# EAGLE design boat5 (EAGLE 7.2.0)
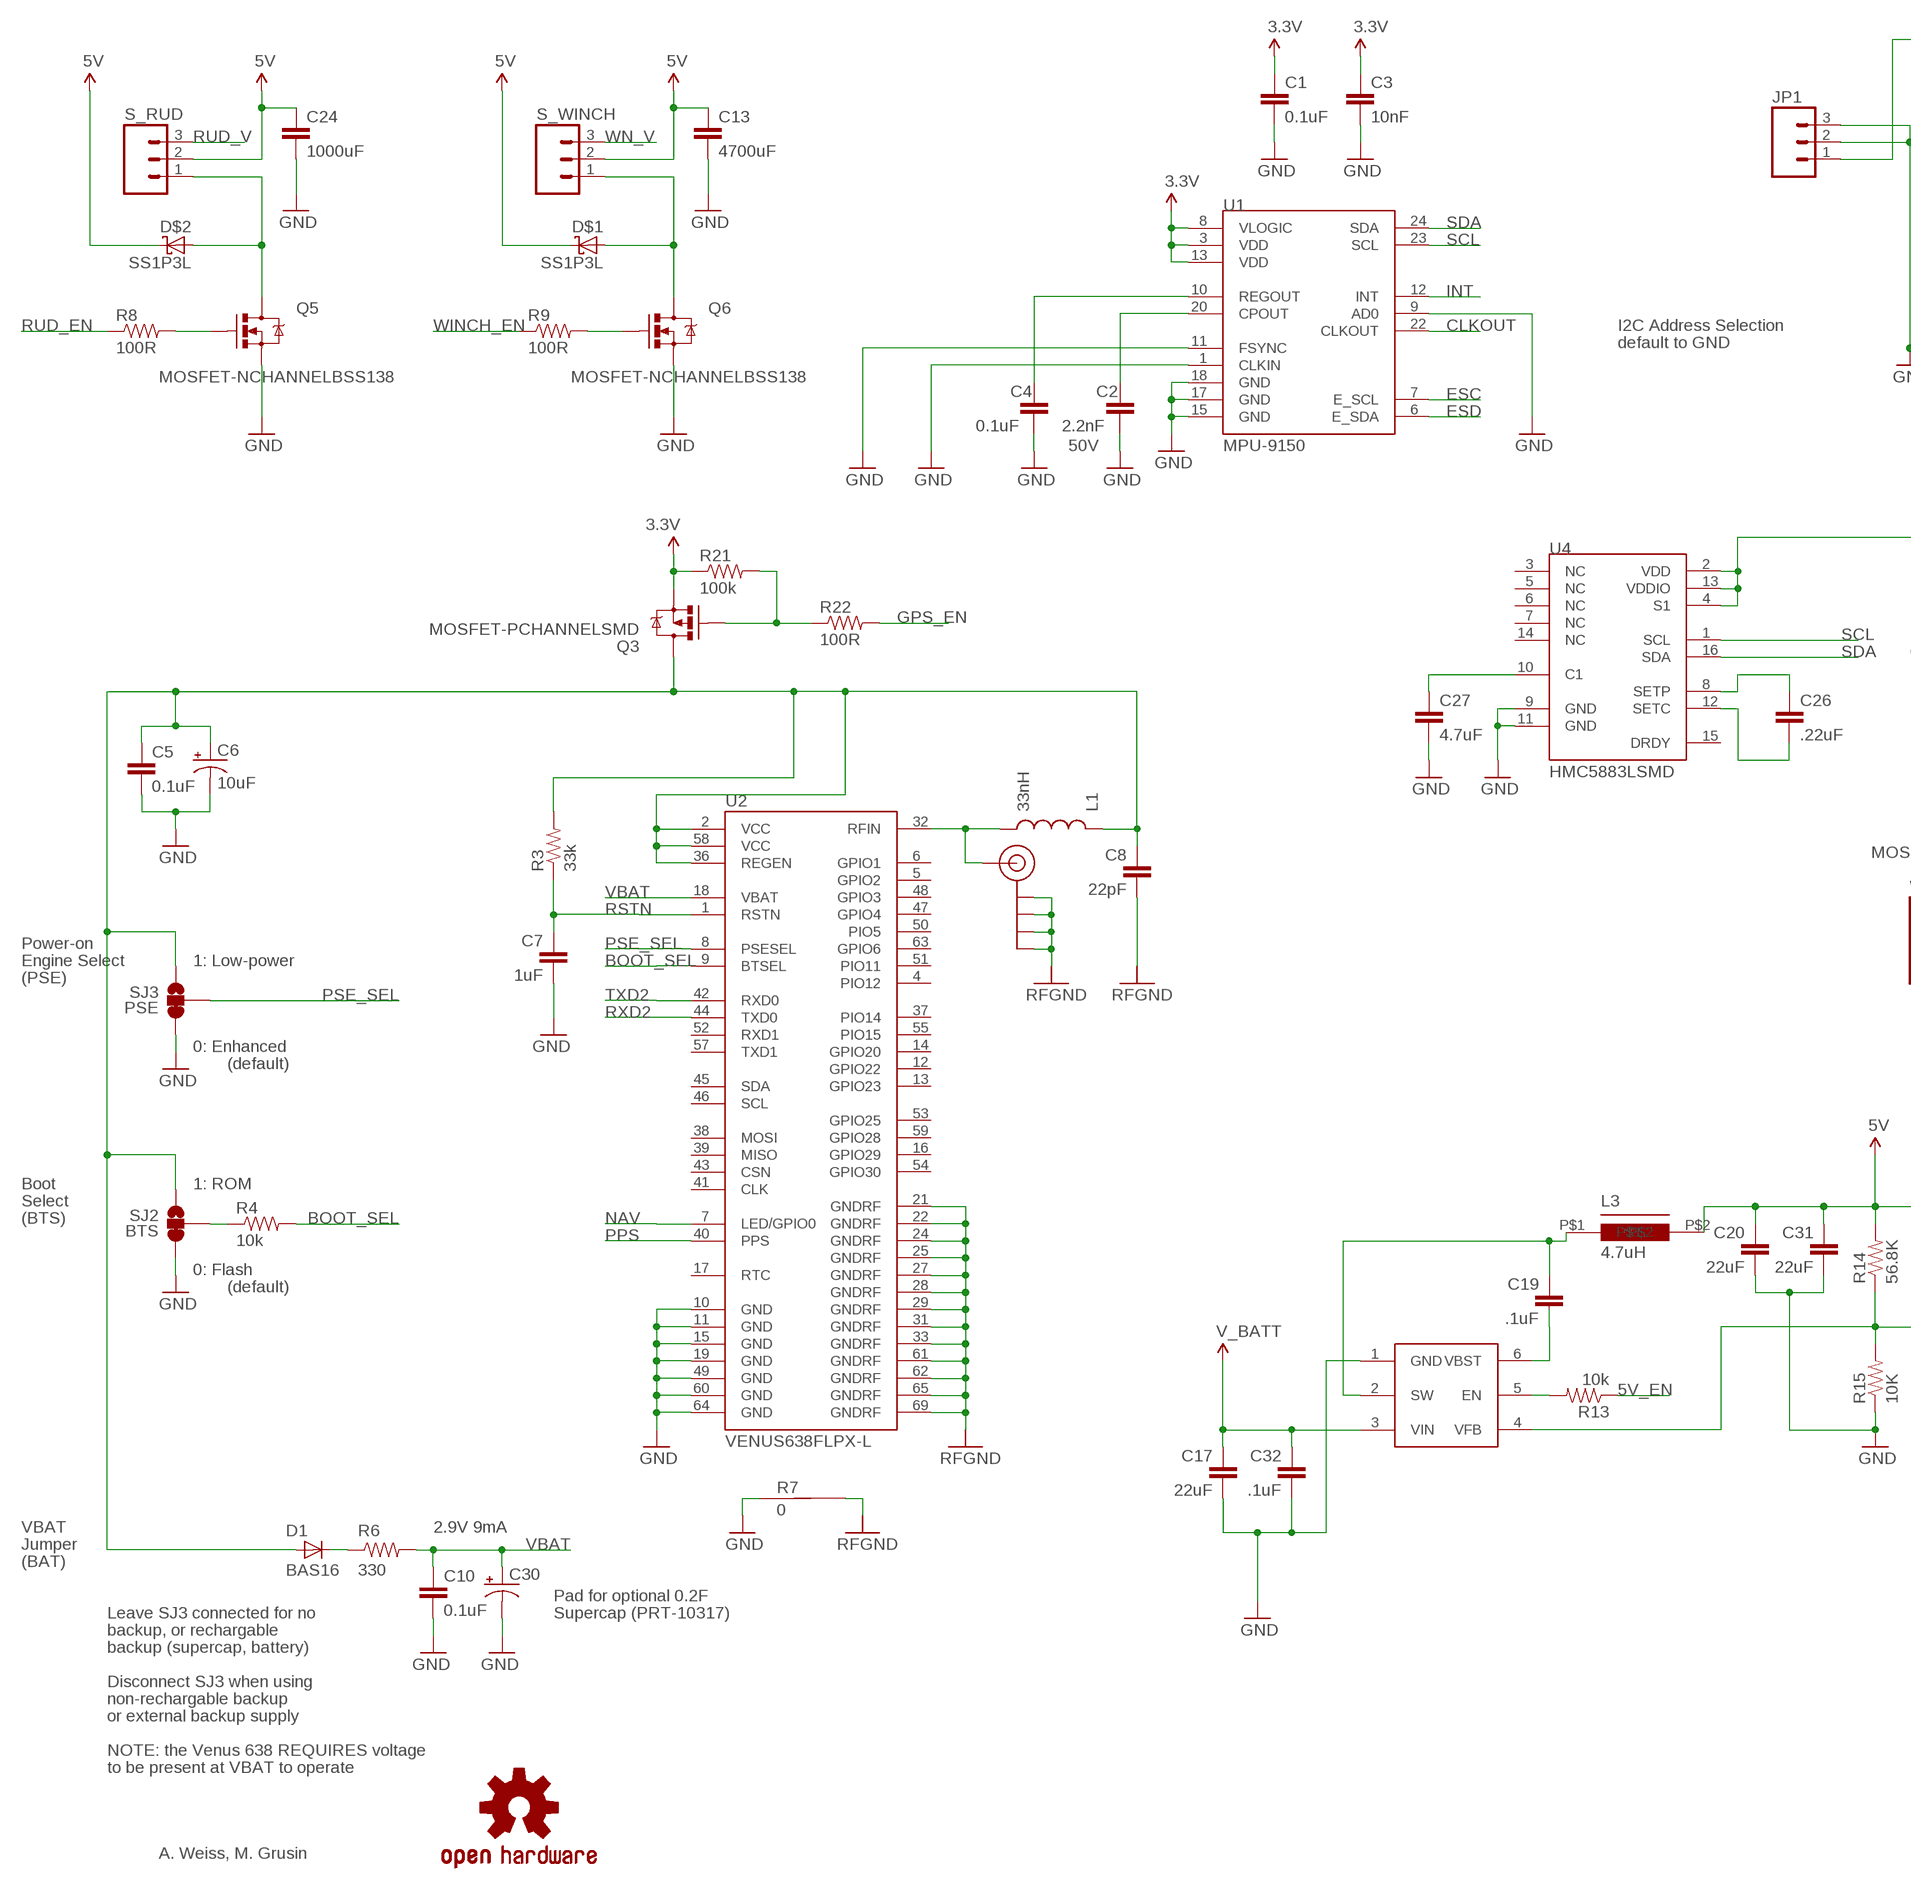
[diagram p0: schematic, sheet 1, part 1 of 2]
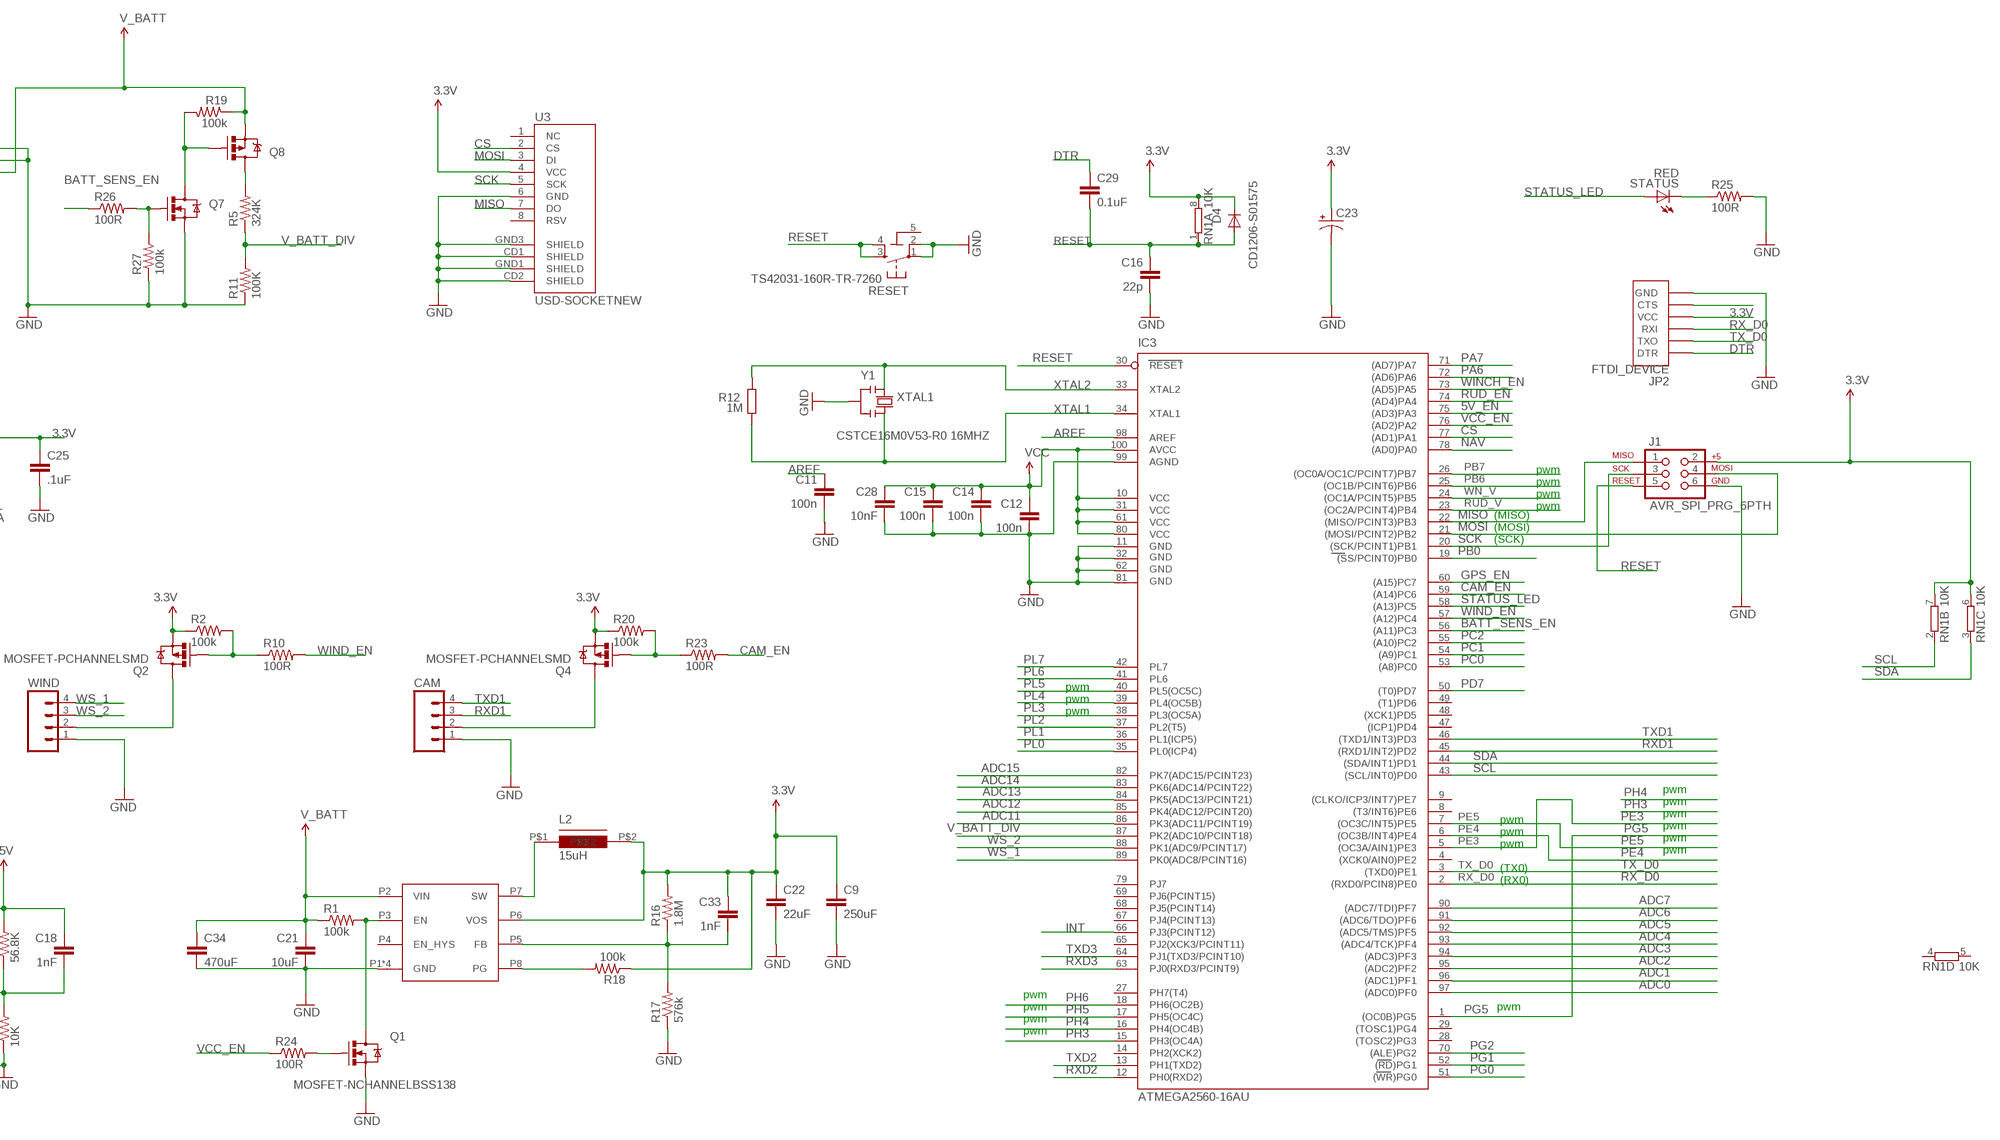
[diagram p1: schematic, sheet 1, part 2 of 2]

## Parts
C1  0.1uF  CAP0603-CAP  [0603-CAP]
C2  2.2nF  CAP0603-CAP  [0603-CAP]
C3  10nF  CAP0603-CAP  [0603-CAP]
C4  0.1uF  CAP0603-CAP  [0603-CAP]
C5  0.1uF  CAP0603-CAP  [0603-CAP]
C6  10uF  CAP_POL1206  [EIA3216]
C7  1uF  CAP0603-CAP  [0603-CAP]
C8  22pF  CAP0603-CAP  [0603-CAP]
C9  250uF  CAPPTH1  [CAP-PTH-5MM]
C10  0.1uF  CAP0603-CAP  [0603-CAP]
C11  100n  C-EU0603-RND  [C0603-ROUND]
C12  100n  C-EU0603-RND  [C0603-ROUND]
C13  4700uF  CAPPTH1  [CAP-PTH-5MM]
C14  100n  C-EU0603-RND  [C0603-ROUND]
C15  100n  C-EU0603-RND  [C0603-ROUND]
C16  22p  C-EU0603-RND  [C0603-ROUND]
C17  22uF  CAP1206  [1206]
C18  1nF  CAP0805  [0805]
C19  .1uF  CAP0805  [0805]
C20  22uF  CAP1206  [1206]
C21  10uF  CAP0805  [0805]
C22  22uF  CAP0805  [0805]
C23  CAP_POL  [DSK-621]
C24  1000uF  CAPPTH1  [CAP-PTH-5MM]
C25  .1uF  CAP0603-CAP  [0603-CAP]
C26  .22uF  CAP0603-CAP  [0603-CAP]
C27  4.7uF  CAP0603-CAP  [0603-CAP]
C28  10nF  CAP0603-CAP  [0603-CAP]
C29  0.1uF  CAP0402-CAP  [0402-CAP]
C30  CAP_POL  [DSK-621]
C31  22uF  CAP1206  [1206]
C32  .1uF  CAP0805  [0805]
C33  1nF  CAP0402-CAP  [0402-CAP]
C34  470uF  CAPPTH1  [CAP-PTH-5MM]
CAM  M04PTH  [1X04]
D1  BAS16  DIODESOD  [SOD-323]
D4  CD1206-S01575  DIODE-MINIMELF  [MINIMELF]
D$1  SS1P3L  [MICROSMP]
D$2  SS1P3L  [MICROSMP]
IC3  ATMEGA2560-16AU  ATMEGA25602560-16AU  [TQFP100]
J1  AVR_SPI_PRG_6PTH  [2X3]
JP1  M03SCREW  [SCREWTERMINAL-3.5MM-3]
JP2  FTDI_DEVICE  [FTDI_DEVICE_SIDE]
JP5  SMA_EDGE  [SMA-EDGE]
L1  33nH  INDUCTOR0603  [0603]
L2  15uH  VLCF4020  [VLCF4020]
L3  4.7uH  SLF60287055  [SLF7055]
Q1  MOSFET-NCHANNELBSS138  [SOT23]
Q2  MOSFET-PCHANNELSMD  [SOT23-3]
Q3  MOSFET-PCHANNELSMD  [SOT23-3]
Q4  MOSFET-PCHANNELSMD  [SOT23-3]
Q5  MOSFET-NCHANNELBSS138  [SOT23]
Q6  MOSFET-NCHANNELBSS138  [SOT23]
Q7  MOSFET-NCHANNELBSS138  [SOT23]
Q8  MOSFET-PCHANNELSMD  [SOT23-3]
R1  100k  RESISTOR0603  [0603-RES]
R2  100k  RESISTOR0603  [0603-RES]
R3  33k  RESISTOR0603-RES  [0603-RES]
R4  10k  RESISTOR0603-RES  [0603-RES]
R5  324K  RESISTOR0603-RES  [0603-RES]
R6  330  RESISTOR0603-RES  [0603-RES]
R7  0  GND-JUMP  [GND-JUMP]
R8  100R  RESISTOR0603  [0603-RES]
R9  100R  RESISTOR0603  [0603-RES]
R10  100R  RESISTOR0603  [0603-RES]
R11  100K  RESISTOR0603-RES  [0603-RES]
R12  1M  R-EU_R0603  [R0603-ROUND]
R13  10k  RESISTOR0603  [0603-RES]
R14  56.8K  RESISTOR0603  [0603-RES]
R15  10K  RESISTOR0603  [0603-RES]
R16  1.8M  RESISTOR0603  [0603-RES]
R17  576k  RESISTOR0603  [0603-RES]
R18  100k  RESISTOR0603  [0603-RES]
R19  100k  RESISTOR0603  [0603-RES]
R20  100k  RESISTOR0603  [0603-RES]
R21  100k  RESISTOR0603  [0603-RES]
R22  100R  RESISTOR0603  [0603-RES]
R23  100R  RESISTOR0603  [0603-RES]
R24  100R  RESISTOR0603  [0603-RES]
R25  100R  RESISTOR0603  [0603-RES]
R26  100R  RESISTOR0603  [0603-RES]
R27  100k  RESISTOR0603  [0603-RES]
RESET  TS42031-160R-TR-7260  TS42  [TS42]
RN1  10K  4R-NCAT16  [CAT16]
S_RUD  M03PTH  [1X03]
S_WINCH  M03PTH  [1X03]
SJ2  BTS  SOLDERJUMPER_2WAYPASTE2&3  [SJ_3_PASTE2&3]
SJ3  PSE  SOLDERJUMPER_2WAYPASTE2&3  [SJ_3_PASTE2&3]
STATUS  RED  LED-RED0603  [LED-0603]
U1  MPU-9150  MPU-9150QFN-24-NP  [QFN-24-NP]
U2  VENUS638FLPX-L  [VENUS638FLPX]
U3  USD-SOCKETNEW  [MICRO-SD-SOCKET-PP]
U4  HMC5883LSMD  [16LPCC]
U$1  TPS62125  [S-PWSON-N8]
U$2  TPS56X200  [SOT23-6]
U$4  OSHW-LOGOS  [OSHW-LOGO-S]
WIND  M04PTH  [1X04]
Y1  CSTCE16M0V53-R0 16MHZ  RESONATORMU  [RESONATOR]

## Nets
3.3V: C1.1 C3.1 C9.1 C12.1 C14.1 C15.1 C22.1 C23.VCC(+) C25.1 C28.1 C33.1 D4.C IC3.10(VCC) IC3.31(VCC1) IC3.61(VCC2) IC3.80(VCC3) IC3.100(AVCC) J1.2 JP2.P$4(VCC) L2.P$2 Q2.2(S) Q3.2(S) Q4.2(S) R2.1 R16.2 R18.1 R20.1 R21.1 RN1.6 RN1.7 RN1.8 U1.3(VDD) U1.8(VLOGIC) U1.13(VDD) U3.4(VCC) U4.2(VDD) U4.4(S1) U4.13(VDDIO) U$1.P6(VOS) ; supply symbol labelled VCC
5V: C13.1 C18.1 C20.1 C24.1 C31.1 D$1.C D$2.C L3.P$2 R14.2 S_RUD.2 S_WINCH.2
5V_EN: IC3.75((AD3)PA3) R13.1
ADC0: IC3.97((ADC0)PF0)
ADC1: IC3.96((ADC1)PF1)
ADC2: IC3.95((ADC2)PF2)
ADC3: IC3.94((ADC3)PF3)
ADC4: IC3.93((ADC4/TCK)PF4)
ADC5: IC3.92((ADC5/TMS)PF5)
ADC6: IC3.91((ADC6/TDO)PF6)
ADC7: IC3.90((ADC7/TDI)PF7)
ADC11: IC3.86(PK3(ADC11/PCINT19))
ADC12: IC3.85(PK4(ADC12/PCINT20))
ADC13: IC3.84(PK5(ADC13/PCINT21))
ADC14: IC3.83(PK6(ADC14/PCINT22))
ADC15: IC3.82(PK7(ADC15/PCINT23))
ANT: JP5.SIG(SIGNAL) L1.2 U2.32(RFIN)
AREF: C11.1 IC3.98(AREF)
BATT_SENS_EN: IC3.56((A11)PC3) R26.1
BOOT_SEL: R4.2 U2.9(BTSEL)
CAM_EN: IC3.59((A14)PC6) R23.2
CLKOUT: U1.22(CLKOUT)
CS: IC3.77((AD1)PA1) U3.2(CS)
DTR: C29.1 JP2.P$1(DTR)
ESC: U1.7(E_SCL)
ESD: U1.6(E_SDA)
GND: C1.2 C2.2 C3.2 C4.2 C5.2 C6.C(-) C7.2 C9.2 C10.2 C11.2 C12.2 C13.2 C14.2 C15.2 C16.2 C17.2 C20.2 C21.2 C22.2 C23.GND(-) C24.2 C25.2 C27.2 C28.2 C30.GND(-) C31.2 C32.2 C34.2 CAM.1 IC3.11(GND) IC3.32(GND1) IC3.62(GND2) IC3.81(GND3) IC3.99(AGND) J1.6 JP1.2 JP1.3 JP2.P$6(GND) Q1.2(S) Q5.2(S) Q6.2(S) Q7.2(S) R7.1 R11.1 R15.1 R17.1 R25.2 R27.1 RESET.1 RESET.2 SJ2.3 SJ3.3 U1.1(CLKIN) U1.9(AD0) U1.11(FSYNC) U1.15(GND) U1.17(GND) U1.18(GND) U2.10(GND) U2.11(GND) U2.15(GND) U2.19(GND) U2.49(GND) U2.60(GND) U2.64(GND) U3.6(GND) U3.CD1(SHIELD) U3.CD2(SHIELD) U3.GND1(SHIELD) U3.GND3(SHIELD) U4.9(GND) U4.11(GND) U$1.P1(GND) U$1.P_THERM(GND) U$1.P_THERM_VIA1(GND) U$1.P_THERM_VIA(GND) U$2.1(GND) WIND.1 Y1.2
GPS_EN: IC3.60((A15)PC7) R22.2
GPS_PWR: C5.1 C6.A(+) C8.1 D1.2(A) L1.1 Q3.3(D) R3.2 SJ2.1 SJ3.1 U2.2(VCC) U2.36(REGEN) U2.58(VCC)
INT: IC3.66(PJ3(PCINT12)) U1.12(INT)
MISO: IC3.22((MISO/PCINT3)PB3) J1.1 U3.7(DO)
MOSI: IC3.21((MOSI/PCINT2)PB2) J1.4 U3.3(DI)
N$1: C2.1 U1.20(CPOUT)
N$2: C4.1 U1.10(REGOUT)
N$3: C26.1 U4.8(SETP)
N$4: R4.1 SJ2.2
N$5: D1.1(C) R6.1
N$7: Q5.1(G) R8.2
N$8: D$1.A Q6.3(D) S_WINCH.1
N$9: D$2.A Q5.3(D) S_RUD.1
N$10: Q6.1(G) R9.2
N$11: C19.1 L3.P$1 U$2.2(SW)
N$13: C26.2 U4.12(SETC)
N$14: L2.P$1 U$1.P7(SW)
N$15: R13.2 U$2.5(EN)
N$16: C27.1 U4.10(C1)
N$17: C33.2 R16.1 R17.2 U$1.P5(FB)
N$18: R18.2 U$1.P8(PG)
N$19: C18.2 R14.1 R15.2 U$2.4(VFB)
N$20: CAM.2 Q4.3(D)
N$21: Q4.1(G) R20.2 R23.1
N$22: Q3.1(G) R21.2 R22.1
N$23: Q1.3(D) R1.2 U$1.P3(EN)
N$24: Q1.1(G) R24.2
N$25: JP2.P$5(CTS)
N$26: Q2.3(D) WIND.2
N$27: R25.1 STATUS.C
N$28: Q2.1(G) R2.2 R10.1
N$29: Q8.3(D) R5.2
N$30: Q7.3(D) Q8.1(G) R19.2
N$31: Q7.1(G) R26.2 R27.2
N$32: C19.2 U$2.6(VBST)
NAV: IC3.78((AD0)PA0) U2.7(LED/GPIO0)
PA6: IC3.72((AD6)PA6)
PA7: IC3.71((AD7)PA7)
PB0: IC3.19((SS/PCINT0)PB0)
PB6: IC3.25((OC1B/PCINT6)PB6)
PB7: IC3.26((OC0A/OC1C/PCINT7)PB7)
PC0: IC3.53((A8)PC0)
PC1: IC3.54((A9)PC1)
PC2: IC3.55((A10)PC2)
PD7: IC3.50((T0)PD7)
PE3: IC3.5((OC3A/AIN1)PE3)
PE4: IC3.6((OC3B/INT4)PE4)
PE5: IC3.7((OC3C/INT5)PE5)
PG0: IC3.51((WR)PG0)
PG1: IC3.52((RD)PG1)
PG2: IC3.70((ALE)PG2)
PG5: IC3.1((OC0B)PG5)
PH3: IC3.15(PH3(OC4A))
PH4: IC3.16(PH4(OC4B))
PH5: IC3.17(PH5(OC4C))
PH6: IC3.18(PH6(OC2B))
PL0: IC3.35(PL0(ICP4))
PL1: IC3.36(PL1(ICP5))
PL2: IC3.37(PL2(T5))
PL3: IC3.38(PL3(OC5A))
PL4: IC3.39(PL4(OC5B))
PL5: IC3.40(PL5(OC5C))
PL6: IC3.41(PL6)
PL7: IC3.42(PL7)
PPS: U2.40(PPS)
PSE_SEL: SJ3.2 U2.8(PSESEL)
RESET: C16.1 C29.2 D4.A IC3.30(RESET) J1.5 RESET.3 RESET.4 RN1.1
RFGND: C8.2 JP5.GND@0(GND) JP5.GND@1(GND) JP5.GND@2(GND) JP5.GND@3(GND) R7.2 U2.21(GNDRF) U2.22(GNDRF) U2.24(GNDRF) U2.25(GNDRF) U2.27(GNDRF) U2.28(GNDRF) U2.29(GNDRF) U2.31(GNDRF) U2.33(GNDRF) U2.61(GNDRF) U2.62(GNDRF) U2.65(GNDRF) U2.69(GNDRF)
RSTN: C7.1 R3.1 U2.1(RSTN)
RUD_EN: IC3.74((AD4)PA4) R8.1
RUD_V: IC3.23((OC2A/PCINT4)PB4) S_RUD.3
RX_D0: IC3.2((RXD0/PCIN8)PE0) JP2.P$3(RXI)
RXD1: CAM.3 IC3.45((RXD1/INT2)PD2)
RXD2: IC3.12(PH0(RXD2)) U2.44(TXD0)
RXD3: IC3.63(PJ0(RXD3/PCINT9))
SCK: IC3.20((SCK/PCINT1)PB1) J1.3 U3.5(SCK)
SCL: IC3.43((SCL/INT0)PD0) RN1.2 U1.23(SCL) U4.1(SCL)
SDA: IC3.44((SDA/INT1)PD1) RN1.3 U1.24(SDA) U4.16(SDA)
STATUS_LED: IC3.58((A13)PC5) STATUS.A
TX_D0: IC3.3((TXD0)PE1) JP2.P$2(TXO)
TXD1: CAM.4 IC3.46((TXD1/INT3)PD3)
TXD2: IC3.13(PH1(TXD2)) U2.42(RXD0)
TXD3: IC3.64(PJ1(TXD3/PCINT10))
V_BATT: C17.1 C21.1 C32.1 C34.1 JP1.1 Q8.2(S) R1.1 R19.1 U$1.P2(VIN) U$2.3(VIN)
V_BATT_DIV: IC3.87(PK2(ADC10/PCINT18)) R5.1 R11.2
VBAT: C10.1 C30.VCC(+) R6.2 U2.18(VBAT)
VCC_EN: IC3.76((AD2)PA2) R24.1
WINCH_EN: IC3.73((AD5)PA5) R9.1
WIND_EN: IC3.57((A12)PC4) R10.2
WN_V: IC3.24((OC1A/PCINT5)PB5) S_WINCH.3
WS_1: IC3.89(PK0(ADC8/PCINT16)) WIND.4
WS_2: IC3.88(PK1(ADC9/PCINT17)) WIND.3
XTAL1: IC3.34(XTAL1) R12.1 Y1.3
XTAL2: IC3.33(XTAL2) R12.2 Y1.1
Unconnected: IC3.4((XCK0/AIN0)PE2) IC3.8((T3/INT6)PE6) IC3.9((CLKO/ICP3/INT7)PE7) IC3.14(PH2(XCK2)) IC3.27(PH7(T4)) IC3.28((TOSC2)PG3) IC3.29((TOSC1)PG4) IC3.47((ICP1)PD4) IC3.48((XCK1)PD5) IC3.49((T1)PD6) IC3.65(PJ2(XCK3/PCINT11)) IC3.67(PJ4(PCINT13)) IC3.68(PJ5(PCINT14)) IC3.69(PJ6(PCINT15)) IC3.79(PJ7) RN1.4 RN1.5 U2.4(PIO12) U2.5(GPIO2) U2.6(GPIO1) U2.12(GPIO22) U2.13(GPIO23) U2.14(GPIO20) U2.16(GPIO29) U2.17(RTC) U2.37(PIO14) U2.38(MOSI) U2.39(MISO) U2.41(CLK) U2.43(CSN) U2.45(SDA) U2.46(SCL) U2.47(GPIO4) U2.48(GPIO3) U2.50(PIO5) U2.51(PIO11) U2.52(RXD1) U2.53(GPIO25) U2.54(GPIO30) U2.55(PIO15) U2.57(TXD1) U2.59(GPIO28) U2.63(GPIO6) U3.1(NC) U3.8(RSV) U4.3(NC) U4.5(NC) U4.6(NC) U4.7(NC) U4.14(NC) U4.15(DRDY) U$1.P4(EN_HYS)

## Notes on the sheet
- I2C Address Selection
- default to GND
- 50V
- pwm
- pwm
- pwm
- pwm
- (MISO)
- (MOSI)
- (SCK)
- pwm
- pwm
- pwm
- Power-on
- Engine Select | 1: Low-power
- (PSE)
- RFGND | RFGND
- pwm
- 0: Enhanced
- pwm
- (default)
- pwm
- pwm
- pwm
- pwm
- pwm
- pwm
- pwm
- (TX0)
- (RX0)
- Boot | 1: ROM
- Select
- (BTS)
- 0: Flash
- (default)
- pwm
- pwm | pwm
- pwm
- pwm
- RFGND
- VBAT | 2.9V 9mA
- Jumper | RFGND
- (BAT)
- Pad for optional 0.2F
- Leave SJ3 connected for no | Supercap (PRT-10317)
- backup, or rechargable
- backup (supercap, battery)
- Disconnect SJ3 when using
- non-rechargable backup
- or external backup supply
- NOTE: the Venus 638 REQUIRES voltage
- to be present at VBAT to operate
- A. Weiss, M. Grusin

## Power pins joined to a net without a drawn wire
5-GND: RESET.5(5-GND)

## Library data of the parts
C1-C4 C28 C29 C33 = SparkFun-Passives:CAP: Capacitor Standard 0603 ceramic capacitor, and 0.1" leaded capacitor.
C5 C7 C8 C10 C25-C27 = SparkFun:CAP: Capacitor Standard 0603 ceramic capacitor, and 0.1" leaded capacitor.
C6 = SparkFun:CAP_POL: Capacitor Polarized These are standard SMD and PTH capacitors. Normally 10uF, 47uF, and 100uF in electrolytic and tantalum varieties. Always verify the external diameter of the through hole cap, it varies with capacity, voltage, and manufacturer. The EIA devices should be standard.
C9 C13 C17-C22 C24 C31 C32 C34 = SparkFun-Capacitors:CAP: Capacitor Standard 0603 ceramic capacitor, and 0.1" leaded capacitor.
C11 C12 C14-C16 = SmartPrj:C-EU: CAPACITOR, European symbol
C23 C30 = kolosy:CAP_POL: Capacitor Polarized These are standard SMD and PTH capacitors. Normally 10uF, 47uF, and 100uF in electrolytic and tantalum varieties. Always verify the external diameter of the through hole cap, it varies with capacity, voltage, and manufacturer. The EIA devices should be standard.
CAM WIND = SparkFun-Connectors:M04: Header 4 Standard 4-pin 0.1" header. Use with straight break away headers (SKU : PRT-00116), right angle break away headers (PRT-00553), swiss pins (PRT-00743), machine pins (PRT-00117), and female headers (PRT-00115). Molex polarized connector foot print use with SKU : PRT-08231 with associated crimp pins and housings. 1MM SMD Version SKU: PRT-10208
D1 = SparkFun:DIODE: Diode These are standard reverse protection diodes and small signal diodes. SMA package can handle up to about 1A. SOD-323 can handle about 200mA. What the SOD-323 package when ordering, there are some mfgs out there that are 5-pin packages.
D4 = diode:DIODE-: DIODE
D$1 D$2 = kolosy:SS1P3L: Surface Mount Schottky Barrier Rectifiers (http://www.vishay.com/docs/89020/mss1p3l.pdf)
IC3 = SmartPrj:ATMEGA2560: MICROCONTROLLER 64/128/256 Kbytes FLASH 4 Kbytes EEPROM 8 Kbytes SRAM 86 General Purpose I/O pins 12-channels16-bit PWM 4 x Serial USARTs 16-channels 10-bit A/D
J1 = SparkFun-Connectors:AVR_SPI_PRG_6: AVR ISP 6 Pin This is the reduced ISP connector for AVR programming. Common on Arduino. This footprint will take up less PCB space and can be used with a 10-pin to 6-pin adapter such as SKU: BOB-08508
JP1 S_RUD S_WINCH = SparkFun-Connectors:M03: Header 3 Standard 3-pin 0.1" header. Use with straight break away headers (SKU : PRT-00116), right angle break away headers (PRT-00553), swiss pins (PRT-00743), machine pins (PRT-00117), and female headers (PRT-00115). Molex polarized connector foot print use with SKU : PRT-08232 with associated crimp pins and housings.
JP2 = SparkFun-Connectors:FTDI_DEVICE: Connector which mates to FTDI basic or FTDI cable.
JP5 = SparkFun:SMA_EDGE: SMA Antenna Connector End launch SMA connector. The paste layer has been removed so that the connector can be hand soldered onto the board after reflow.
L1 = SparkFun:INDUCTOR: Inductors Basic Inductor/Choke - 0603 and 1206. Footprints are not proven and vary greatly between part numbers.
L2 = kolosy:VLCF4020
L3 = kolosy:SLF6028
Q1 Q5-Q7 = SparkFun-DiscreteSemi:MOSFET-NCHANNEL: Common NMOSFET Parts MFG P/N Store ID Prod ID FDD8780 TRANS-09984 SI7820DN TRANS-11055 FDS6630A IC-08089 2N7002PW TRANS-11151 FQP30N06L COM-10213 TRANS-10060 BSS123LT1G TRANS-08345 BSS138 TRANS-00830 BS170 2N7000; PROD_ID: TRANS-00830
Q2-Q4 Q8 = SparkFun-DiscreteSemi:MOSFET-PCHANNEL: Generic PMOSFET
R1 R2 R8-R10 R13-R27 = SparkFun-Resistors:RESISTOR: Resistor Basic schematic elements and footprints for 0603, 1206, and PTH resistors.
R3 R4 R6 = SparkFun:RESISTOR: Resistor Basic schematic elements and footprints for 0603, 1206, and PTH resistors.
R5 R11 = SparkFun-Passives:RESISTOR: Resistor Basic schematic elements and footprints for 0603, 1206, and PTH resistors.
R7 = mike-temp:GND-JUMP: Zero-Ohm trace for connecting different ground planes at a single point.
R12 = SmartPrj:R-EU_: RESISTOR, European symbol
RESET = SmartPrj:TS42: TS42 Dongnan Electronics Tact switch VDC 12V - 50mA
RN1 = resistor-dil:4R-N: Array Chip Resistor Source: RS Component / Phycomp
SJ2 SJ3 = SparkFun:SOLDERJUMPER_2WAY: Solder Jumper 2 way solder jumper
STATUS = SparkFun-LED:LED-RED: Assorted Red LEDs LilyPad 1206- DIO-09912 1206- DIO-00809 0603- DIO-00819; PROD_ID: DIO-00819
U1 = SparkFun-Sensors:MPU-9150: 9DOF (3mag, 3accel, 3rotat). I2C interface.
U2 = mike-temp:VENUS638FLPX-L: Venus638FLPX-L GPS Receiver Venus638FLPx is a high performance, low cost, single chip GPS receiver targeting mobile consumer and cellular handset applications. It offers very low power consumption, high sensitivity, and best in class signal acquisition and time-to-first-fix performance. Venus638FLPx contains all the necessary components of a complete GPS receiver, includes 1.2dB cascaded system NF RF front-end, GPS baseband signal processor, 0.5ppm TCXO, 32.768kHz RTC crystal, RTC LDO regulator, and passive components. It requires very low external component count and takes up only 100mm2 PCB footprint. Dedicated massive-correlator signal parameter search engine within the baseband enables rapid search of all the available satellites and acquisition of very weak signal. An advanced track engine allows weak signal tracking and positioning in harsh environments such as urban canyons and under deep foliage. The self-contained architecture keeps GPS processing off the host and allows integration into applications with very little resource. FEATURES 20Hz update rate -148dBm cold start sensitivity -165dBm tracking sensitivity 29 second cold start TTFF 3.5 second TTFF with AGPS 1 second hot start 2.5m accuracy Multipath detection and suppression Jamming detection and mitigation SBAS (WAAS / EGNOS) support 7-day extended ephemeris AGPS 67mW full power navigation Works directly with active or passive antenna Internal flash for optional 75K point data logging Supports external SPI flash memory data logging Complete receiver in 10mm x 10mm x 1.3mm size Contains LNA, SAW Filter, TCXO, RTC Xtal, LDO Pb-free RoHS compliant
U3 = SparkFun:USD-SOCKET: microSD Socket Push-push type uSD socket. Schematic element and footprint production proven. Spark Fun Electronics SKU : PRT-00127. tDoc lines correctly indicate media card edge positions when inserting (unlocked, locked, depressed).
U4 = SparkFun:HMC5883L: 3 Axis Digital Compass IC
U$1 = kolosy:TPS62125
U$2 = kolosy:TPS56X200
U$4 = SparkFun:OSHW-LOGO: Open Source Hardware Logo This logo indicates the piece of hardware it is found on incorporates a OSHW license and/or adheres to the definition of open source hardware found here: http://freedomdefined.org/OSHW
Y1 = SmartPrj:RESONATOR

## Net classes
0 default: width 0.203 mm, drill 0.406 mm, clearance 0.203 mm
2 gnd: width 0.305 mm, drill 0.406 mm, clearance 0.203 mm
3 power usb: width 0.508 mm, drill 0.406 mm, clearance 0.203 mm

## Board
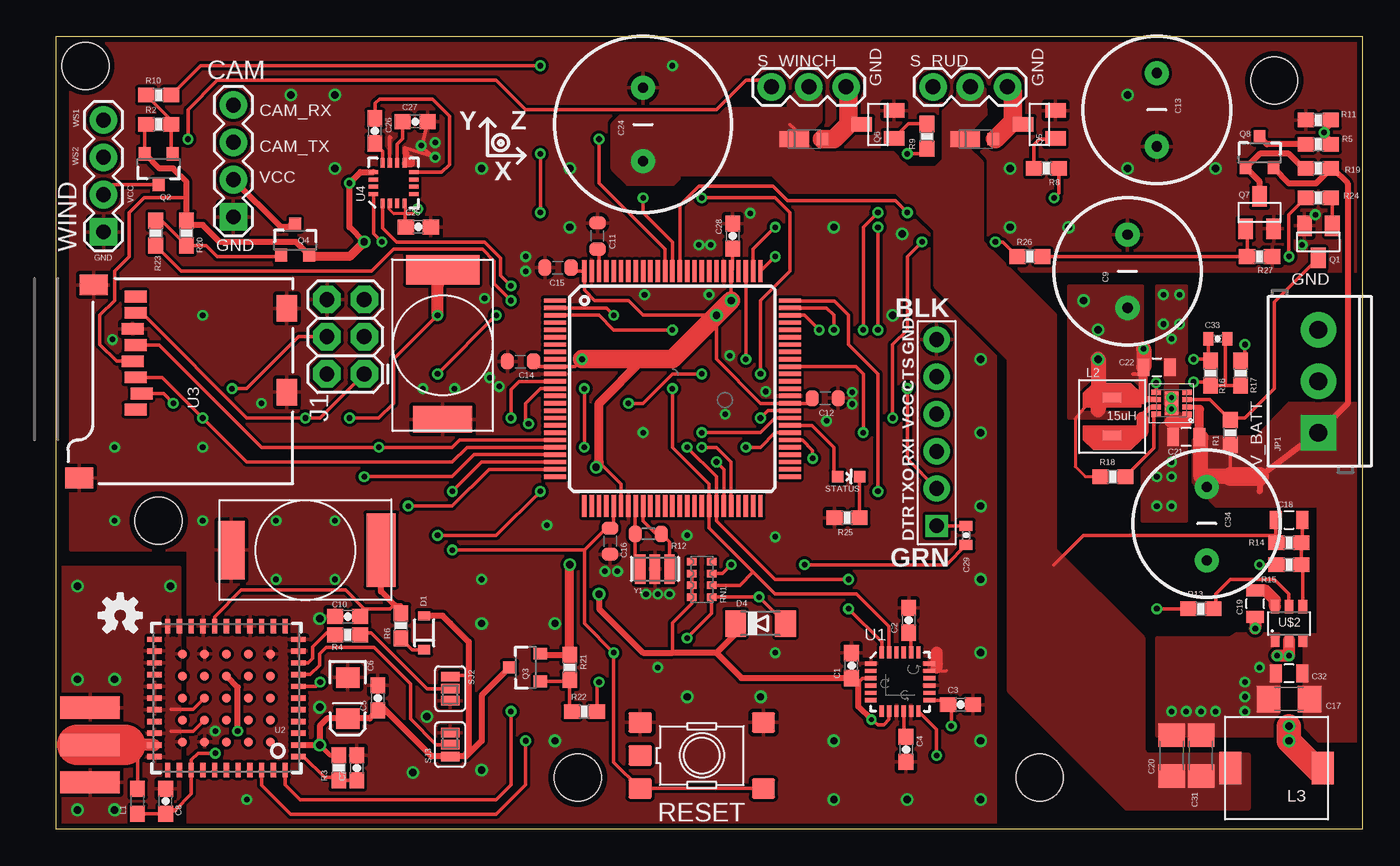
[diagram p2: board, top side]
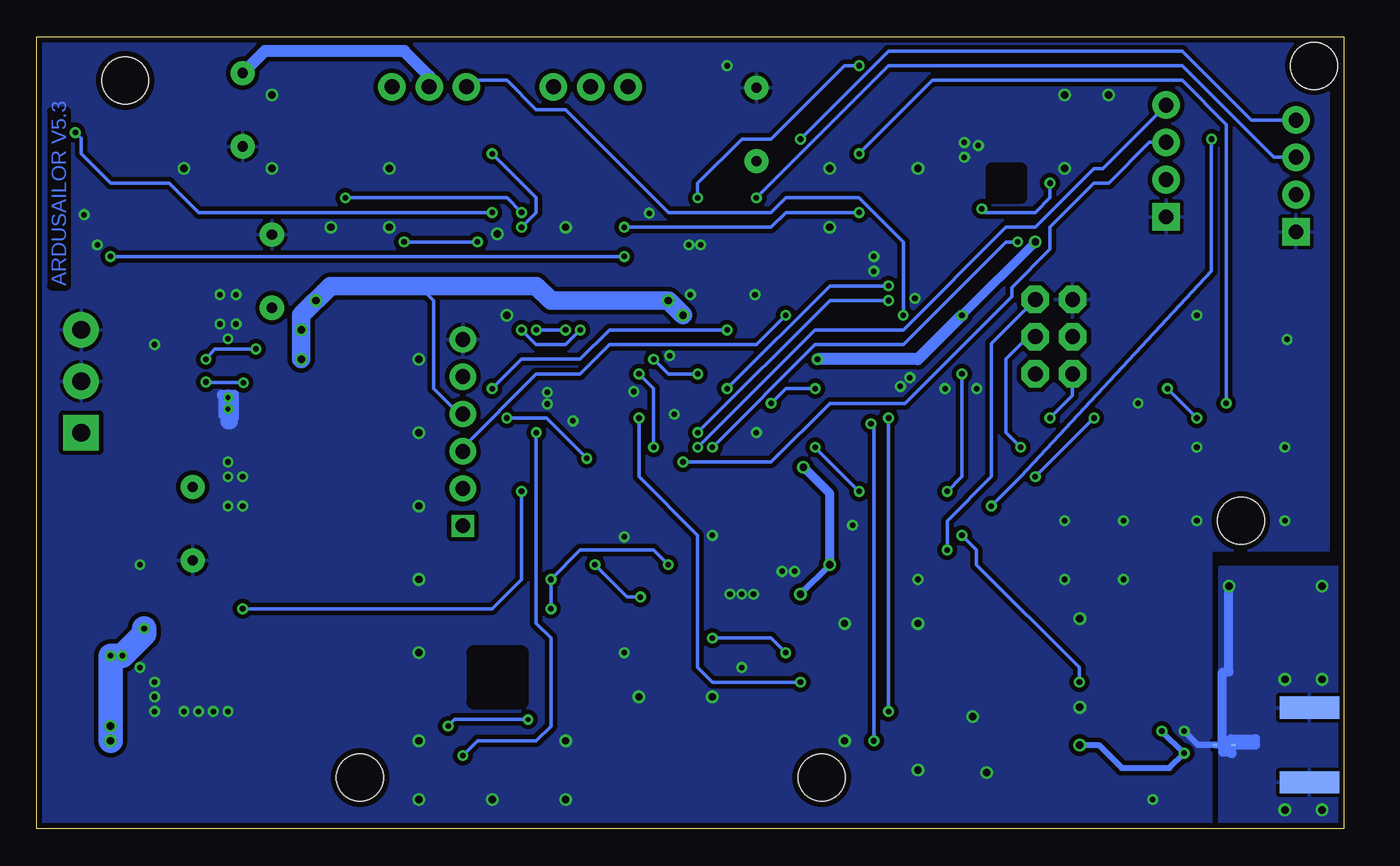
[diagram p3: board, bottom side, seen from below]

Size 89.03 x 53.98 mm. Coordinates in mm from the lower left corner, seen from the top.
Outline: 0,0 89.03,0 89.03,53.98 0,53.98 0,0
Copper layers (1*16): Top 0.0356mm / dielectric 1.5011mm / Bottom 0.0356mm
Design rules "oshpark *": minimum track width 0.1523mm, minimum drill 0.3301mm, track to track 0.1523mm, track to pad 0.1523mm, pad to pad 0.1523mm, via to via 0.1523mm, smd to smd 0.1523mm, copper to edge 0.3809mm, drill to drill 0.1523mm, minimum pad ring 7mil, minimum via ring 7mil, stop-mask expansion 3mil, vias tented up to drill 15mil, thermal gap 10mil
Holes 3.2 mm at 7,21 35.55,3.5 67,3.5 83,51 2,52
tRestrict: area 22,43 to 23.9,45; area 56.1,8.7 to 58.9,11.4
bRestrict: area 56,8.7 to 59.2,12; area 22,43 to 23.9,45

### Footprints (pad centres in the part's own frame; a part is rotated, then mirrored left to right if it is on the bottom)
0603-CAP = smd 1.1 x 1: 1 -0.85,0; 2 0.85,0
EIA3216 = smd 1.4 x 1.6: A 1.4,0; C -1.4,0
CAP-PTH-5MM = drill 0.7 pad 1.651: 1 -2.5,0; 2 2.5,0
C0603-ROUND = smd 0.898 x 1.1: 1 -0.889,0; 2 0.889,0
1206 = smd 1.6 x 1.8: 1 -1.4,0; 2 1.4,0
0805 = smd 0.8 x 1.2: 1 -0.9,0; 2 0.9,0
DSK-621 = smd 4 x 1.8: GND 0,-5.05 | smd 5 x 2: VCC 0,5.15
0402-CAP = smd 0.7 x 0.9: 1 -0.65,0; 2 0.65,0
1X04 = drill 1.016 pad 1.88 square: 1 0,0 | drill 1.016 pad 1.88: 2 2.54,0; 3 5.08,0; 4 7.62,0
SOD-323 = smd 0.63 x 0.83: 1 -1.15,0; 2 1.15,0
MINIMELF = smd 1.4 x 1.8: A 1.7,0; C -1.7,0
MICROSMP = smd 0.8 x 0.8: A 1.2,0 | smd 2 x 1.1: C -0.7,0
TQFP100 = smd 1.5 x 0.3: 1 -8,6; 2 -8,5.5; 3 -8,5; 4 -8,4.5; 5 -8,4; 6 -8,3.5; 7 -8,3; 8 -8,2.5; 9 -8,2; 10 -8,1.5; 11 -8,1; 12 -8,0.5; 13 -8,0; 14 -8,-0.5; 15 -8,-1; 16 -8,-1.5; 17 -8,-2; 18 -8,-2.5; 19 -8,-3; 20 -8,-3.5; 21 -8,-4; 22 -8,-4.5; 23 -8,-5; 24 -8,-5.5; 25 -8,-6; 51 8,-6; 52 8,-5.5; 53 8,-5; 54 8,-4.5; 55 8,-4; 56 8,-3.5; 57 8,-3; 58 8,-2.5; 59 8,-2; 60 8,-1.5; 61 8,-1; 62 8,-0.5; 63 8,0; 64 8,0.5; 65 8,1; 66 8,1.5; 67 8,2; 68 8,2.5; 69 8,3; 70 8,3.5; 71 8,4; 72 8,4.5; 73 8,5; 74 8,5.5; 75 8,6 | smd 0.3 x 1.5: 26 -6,-8; 27 -5.5,-8; 28 -5,-8; 29 -4.5,-8; 30 -4,-8; 31 -3.5,-8; 32 -3,-8; 33 -2.5,-8; 34 -2,-8; 35 -1.5,-8; 36 -1,-8; 37 -0.5,-8; 38 0,-8; 39 0.5,-8; 40 1,-8; 41 1.5,-8; 42 2,-8; 43 2.5,-8; 44 3,-8; 45 3.5,-8; 46 4,-8; 47 4.5,-8; 48 5,-8; 49 5.5,-8; 50 6,-8; 76 6,8; 77 5.5,8; 78 5,8; 79 4.5,8; 80 4,8; 81 3.5,8; 82 3,8; 83 2.5,8; 84 2,8; 85 1.5,8; 86 1,8; 87 0.5,8; 88 0,8; 89 -0.5,8; 90 -1,8; 91 -1.5,8; 92 -2,8; 93 -2.5,8; 94 -3,8; 95 -3.5,8; 96 -4,8; 97 -4.5,8; 98 -5,8; 99 -5.5,8; 100 -6,8
2X3 = drill 1.016 pad 1.88 octagon: 1 0,0; 2 0,2.54; 3 2.54,0; 4 2.54,2.54; 5 5.08,0; 6 5.08,2.54
SCREWTERMINAL-3.5MM-3 = drill 1.2 pad 2.413 square: 1 0,0 | drill 1.2 pad 2.413: 2 3.5,0; 3 7,0
FTDI_DEVICE_SIDE = drill 1 square: P$1 -6.35,0 | drill 1.016 pad 1.778: P$2 -3.81,0; P$3 -1.27,0; P$4 1.27,0; P$5 3.81,0; P$6 6.35,0
SMA-EDGE = smd 1.524 x 4.064: GND@0 0,0; GND@1 5.08,0; SIG 2.54,0 | smd 1.524 x 4.064 bottom: GND@2 0,0; GND@3 5.08,0
0603 = smd 1.1 x 1: 1 -0.85,0; 2 0.85,0
VLCF4020 = smd 1.27 x 0.635: P$1 0,1.27; P$2 0,-1.27
SLF7055 = smd 1.5 x 2.2: P$1 -3.15,0; P$2 3.15,0
SOT23 = smd 1 x 1.4: 1 -0.95,-1.1; 2 0.95,-1.1; 3 0,1.1
SOT23-3 = smd 0.8 x 0.9: 1 -0.95,-1; 2 0.95,-1; 3 0,1.1
0603-RES = smd 1.1 x 1: 1 -0.85,0; 2 0.85,0
GND-JUMP = smd 0.305 x 0.152: 1 -0.635,0; 2 0.635,0
R0603-ROUND = smd 0.898 x 1.1: 1 -0.889,0; 2 0.889,0
TS42 = smd 1.6 x 1.4: 1 -4.2,2.25; 2 4.2,2.25; 3 -4.2,-2.25; 4 4.2,-2.25; 5 -4.2,0
CAT16 = smd 0.5 x 0.65: 1 -1.2,-0.675; 2 -0.4,-0.675; 3 0.4,-0.675; 4 1.2,-0.675; 5 1.2,0.675; 6 0.4,0.675; 7 -0.4,0.675; 8 -1.2,0.675
1X03 = drill 1.016 pad 1.88: 1 0,0; 2 2.54,0; 3 5.08,0
SJ_3_PASTE2&3 = smd 0.635 x 1.27: 1 -0.813,0; 2 0,0; 3 0.813,0
LED-0603 = smd 0.8 x 0.8: A 0,-0.75; C 0,0.75
QFN-24-NP = smd 0.8 x 0.3: 1 -2,1.25; 2 -2,0.75; 3 -2,0.25; 4 -2,-0.25; 5 -2,-0.75; 6 -2,-1.25; 13 2,-1.25; 14 2,-0.75; 15 2,-0.25; 16 2,0.25; 17 2,0.75; 18 2,1.25 | smd 0.3 x 0.8: 7 -1.25,-2; 8 -0.75,-2; 9 -0.25,-2; 10 0.25,-2; 11 0.75,-2; 12 1.25,-2; 19 1.25,2; 20 0.75,2; 21 0.25,2; 22 -0.25,2; 23 -0.75,2; 24 -1.25,2
VENUS638FLPX = smd 1 x 0.36: 1 -4.9,4; 2 -4.9,3.2; 3 -4.9,2.4; 4 -4.9,1.6; 5 -4.9,0.8; 6 -4.9,0; 7 -4.9,-0.8; 8 -4.9,-1.6; 9 -4.9,-2.4; 10 -4.9,-3.2; 11 -4.9,-4; 23 4.9,-4; 24 4.9,-3.2; 25 4.9,-2.4; 26 4.9,-1.6; 27 4.9,-0.8; 28 4.9,0; 29 4.9,0.8; 30 4.9,1.6; 31 4.9,2.4; 32 4.9,3.2; 33 4.9,4 | smd 0.36 x 1: 12 -4,-4.9; 13 -3.2,-4.9; 14 -2.4,-4.9; 15 -1.6,-4.9; 16 -0.8,-4.9; 17 0,-4.9; 18 0.8,-4.9; 19 1.6,-4.9; 20 2.4,-4.9; 21 3.2,-4.9; 22 4,-4.9; 34 4,4.9; 35 3.2,4.9; 36 2.4,4.9; 37 1.6,4.9; 38 0.8,4.9; 39 0,4.9; 40 -0.8,4.9; 41 -1.6,4.9; 42 -2.4,4.9; 43 -3.2,4.9; 44 -4,4.9 | smd 0.6 x 0.6: 45 -3,3; 46 -3,1.5; 47 -3,0; 48 -3,-1.5; 49 -3,-3; 50 -1.5,3; 51 -1.5,1.5; 52 -1.5,0; 53 -1.5,-1.5; 54 -1.5,-3; 55 0,3; 56 0,1.5; 57 0,0; 58 0,-1.5; 59 0,-3; 60 1.5,3; 61 1.5,1.5; 62 1.5,0; 63 1.5,-1.5; 64 1.5,-3; 65 3,3; 66 3,1.5; 67 3,0; 68 3,-1.5; 69 3,-3
MICRO-SD-SOCKET-PP = smd 0.8 x 1.5: 1 -8.94,10.7; 2 -7.84,10.3; 3 -6.74,10.7; 4 -5.64,10.9; 5 -4.54,10.7; 6 -3.44,10.9; 7 -2.34,10.7; 8 -1.24,10.7 | smd 1.8 x 1.4: CD1 -2.05,0.4; CD2 -7.75,0.4 | smd 1.4 x 1.9: GND1 -13.6,14.55; GND3 -0.45,13.55
16LPCC = smd 0.65 x 0.28: 1 -1.37,0.75; 2 -1.37,0.25; 3 -1.37,-0.25; 4 -1.37,-0.75; 9 1.37,-0.75; 10 1.37,-0.25; 11 1.37,0.25; 12 1.37,0.75 | smd 0.28 x 0.65: 5 -0.75,-1.37; 6 -0.25,-1.37; 7 0.25,-1.37; 8 0.75,-1.37; 13 0.75,1.37; 14 0.25,1.37; 15 -0.25,1.37; 16 -0.75,1.37
S-PWSON-N8 = smd 0.35 x 0.64: P1 -0.75,-1.06; P2 -0.25,-1.06; P3 0.25,-1.06; P4 0.75,-1.06; P5 0.75,1.05; P6 0.25,1.05; P7 -0.25,1.05; P8 -0.75,1.05 | smd 1.6 x 0.9: P_THERM 0,0 | drill 0.33: P_THERM_VIA -0.4,0; P_THERM_VIA1 0.4,0
SOT23-6 = smd 0.6 x 0.9: 1 -0.95,-1.15; 2 0,-1.15; 3 0.95,-1.15; 4 0.95,1.15; 5 0,1.15; 6 -0.95,1.15
RESONATOR = smd 0.7 x 2: 1 -1,0; 2 0,0; 3 1,0

### Placement (x,y rotation side)
C1  54.2,11.13 90 top
C2  58.1,14.22 90 top
C3  61.63,8.47 0 top
C4  57.91,5.42 270 top
C5  21.93,8.92 90 top
C6  19.88,8.92 270 top
C7  20.49,4.16 90 top
C8  7.48,1.89 90 top
C9  73,38 90 top
C10  19.88,14.48 180 top
C11  36.9,40.4 90 top
C12  52.4,29.35 0 top
C13  75,49 270 top
C14  31.65,31.85 180 top
C15  34.2,38.25 180 top
C16  37.75,19.6 270 top
C17  84,8.85 180 top
C18  84,21.05 0 top
C19  81.7,15.35 90 top
C20  76,5 90 top
C21  77,26.7 180 top
C22  75,31.45 0 top
C23  26.35,32.95 0 top
C24  40,48 90 top
C25  24.69,41.01 0 top
C26  21.73,47.56 270 top
C27  24.47,48.19 0 top
C28  46.1,40.4 90 top
C29  62,20 270 top
C30  17,19 270 top
C31  78,5 90 top
C32  84,10.6 180 top
C33  79.15,33.4 0 top
C34  78.4,20.8 270 top
CAM  12.09,41.7 90 top
D1  25.09,13.37 90 top
D4  48,14 0 top
D$1  51,47 0 top
D$2  62.65,47 0 top
IC3  42,30 0 top
J1  21,31 90 top
JP1  86,27 90 top
JP2  60,27 90 top
JP5  2.32,8.26 270 top
L1  5.56,1.88 90 top
L2  71.95,28.1 180 top
L3  83.15,4.15 180 top
Q1  86,40 180 top
Q2  7,45 180 top
Q3  32,11 90 top
Q4  16.3,40.1 0 top
Q5  67,48 90 top
Q6  56,48 90 top
Q7  82,42 0 top
Q8  82,46.05 0 top
R1  80,27 90 top
R2  7,48 0 top
R3  19.27,4.16 90 top
R4  19.88,13.21 180 top
R5  86,46.65 180 top
R6  23.5,13.84 90 top
R7  8.13,5.72 0 bottom
R8  67.48,45 180 top
R9  59.33,47.19 90 top
R10  7,50 0 top
R11  86,48.3 0 top
R12  40.35,20.1 180 top
R13  78,15 0 top
R14  84,19.5 180 top
R15  84,18 0 top
R16  78.65,31.05 90 top
R17  80.7,31.05 270 top
R18  72,24 0 top
R19  86,45 180 top
R20  8.9,40.6 270 top
R21  35,11 270 top
R22  36,8 0 top
R23  6.8,40.6 270 top
R24  86,43 0 top
R25  53.9,21.2 180 top
R26  66.35,39 0 top
R27  82,39 180 top
RESET  44,5 0 top
RN1  44,17 90 top
S_RUD  64.83,50.56 180 top
S_WINCH  53.83,50.56 180 top
SJ2  26.86,9.55 270 top
SJ3  26.86,5.75 90 top
STATUS  54,24 270 top
U1  57.51,10.02 0 top
U2  11.62,8.92 180 top
U3  16.13,37.51 90 top
U4  23,44 90 top
U$1  76,29 90 top
U$2  84,14 0 top
U$4  4.38,14.55 0 top
WIND  3.24,40.68 90 top
Y1  40.8,17.7 0 top

### Tracks (layer width: path | path; a pad name or v marks a point on that pad's centre or on a via)
3.3V  (via drill 0.33, 0.38, 0.4, 0.5)
  Top 0.203: L2.P$2 70.62,29.35 69.44,27.92 69.44,24.68 70.12,24 R18.1 | 34.9,37.95 C15.1 | 35.97,37.95 IC3.100 | R16.2 78.54,32 | U4.2 22.71,42.52 22.71,42.22 23.01,41.91 23.77,41.91 23.77,42.52 U4.4
  Top 0.254: U1.3 55.66,10.26 54.96,10.26 54.65,9.95 54.03,9.95 C1.1 | 56.77,8.23 U1.8 56.76,7.46 56.4,7.1 56,7.1 v55.55,7.45 | 78.55,32 78.54,32 v77.5,32 | C14.1 32.39,31.5 IC3.10 35.35,31.5 v35.85,32 | v46,36 IC3.80 46.1,38.1 C28.1 | 43.5,33.5 45,34.5 45,32 48,29 IC3.61 51.16,29 C12.1 | v45,35 40,35 39,36 36.7,36 36,36.7 IC3.100 35.34,38 C15.1 | 42,12 42,14.05 43.33,15.38 RN1.8 RN1.7 RN1.6 | C15.1 34.89,38.11 | Q3.2 33.1,11.85 | 35,38.34 C15.1 | v20,28 22,28 23,29 23,32 v26,35 | 74.05,31.35 73.7,31 73.35,31 | IC3.31 38.5,23.5 37,25 | U4.13 21.05,44.75 | D4.C 46.3,13.3 | Q2.2 6.05,47.9 R2.1 | U3.4 4.13,31.87 3,33 3,35 4,36 4,38 5,39 5,42 6,43 8.9,43 | U1.13 60.48,8.77 C3.1 61,8.25 v61,7 | C25.1 23.77,41.01 23.77,41.91 24.31,41.91 v24.65,42.25 | 78.54,32 78.5,32 C33.1
  Top 0.406: 54.65,9.95 54.65,8.35 v55.55,7.45 | U$1.P6 74.05,29.25 | v37,16 37,15 40,12 42,12 45,12 | C14.1 32.45,31.6 | 45,12 46.7,10.29 49.31,10.28 C1.1 | 33.1,11.85 R21.1 | 17.25,39 Q4.2 16.35,40 11.15,40 10,41.15 9.2,41.15 R20.1 8.9,43 8.9,44.1 8,45 7.05,45 Q2.2 | 46.3,13.3 45,12 | v21,40 20,41 v20,44 20.75,44.75 U4.13
  Top 0.61: 72.85,29.25 74.05,29.25 74.05,31.35 C22.1 | v36.8,24.65 36.8,24.75 37,25 37,29 40,32 | v21,40 20,39 17.25,39 | R21.1 v35,18
  Top 0.813: v26,35 26,37 C23.VCC
  Top 1.016: v74.1,32.7 C22.1 | v71,32 71,28.57
  Top 1.27: v35.85,32 40,32 42,32 43.5,33.5 v45,35 v46,36
  Bottom 0.254: v55.55,7.45 60.55,7.45 v61,7 | v77.5,32 76.9,32.7 v74.1,32.7 | J1.2 18.46,29.54 v20,28 | JP2.P$4 60.27,28.27 62,30 62,36 63,37 | v24.65,42.25 24.4,42 21,42 20,43 v20,44
  Bottom 0.406: v37,16 v35,18
  Bottom 0.61: v35,18 35,22.85 v36.8,24.65 | v21,40 v26,35
  Bottom 0.813: v26,35 29,32 v35.85,32
  Bottom 1.27: v71,32 v71,34 71,35 69,37 63,37 55,37 54,36 v46,36 v45,35
  other vias: 70,36
  pour Top (no thermals): 69,28 69,37 74,37 74,30 73,30 73,28
5V
  Top 0.254: D$1.C 50.3,47.7 50,48 | 68,18 70,20 83.15,20 R14.2 83.1,19.55 C18.1
  Top 0.813: S_WINCH.2 51.29,50.29
  Bottom 0.813: S_RUD.2 62.29,51.29 64,53 73.5,53 C13.1
  pour Top (no thermals): 81.2,1.45 73,1.4 65,9.4 65,36.6 68,33.6 68,19 74,13 74,5.35 74.25,5 81.2,5
  pour Top (no thermals): 68,32 65,32 60,37 60,41 59,42 59,44 61,46 61,47 62,47 62,46.4 63,45.4 63,40 68,35
  pour Top (no thermals): 60,40.85 57.75,43 57.3,43.45 50.05,43.45 48.85,44.65 42.35,44.65 42.35,44.35 42,44 39,44 38,45 38,48 39,49 50,49 50,49.7 51,50.7 52,49.95 52,48.25 51.6,47.85 51.1,47.85 51.1,46.55 51.65,46 57,46 58,45 60,45
  pour Top (no thermals): 60,45 60.45,45.45 60.45,48.9 61.35,49.8 61.45,50 61.45,50.45 62,51 62.55,51 63.3,50.4 63.35,48.65 62.25,47.55 62.25,45.25 62,45
5V_EN  (via drill 0.38)
  Top 0.203: 50.14,35.97 IC3.75
  Top 0.254: 50.14,35.97 53.03,35.97 54,35 54,33 56,31 v56,23 56.15,23.15 | R13.1 v75,15
  Bottom 0.254: v56,23 56,17 58,15 v75,15
ANT
  Top 0.254: L1.2 5.56,5.43 5.27,5.72 | JP5.SIG
  Top 0.813: U2.32 5.27,5.72 4.74,5.72
  Top 2.769: 1.46,5.72 JP5.SIG 4.74,5.72
AREF
  Top 0.254: IC3.98 37,39.41 C11.1
BATT_SENS_EN  (via drill 0.38)
  Top 0.254: v51.55,25.25 51.55,25.8 50.85,26.5 IC3.56 | v57,28 57,33 58,34 58,39 v59,40 | v64,40 64.5,40 R26.1
  Bottom 0.254: v59,40 v64,40 | v51.55,25.25 54.3,28 v57,28
BOOT_SEL
  Top 0.254: U2.9 17.18,11.31 17.49,11.62 17.49,12.41 18.45,13.37 19.02,13.37 R4.2
CAM_EN  (via drill 0.38)
  Top 0.254: v31,36 29.85,37.15 29.85,38.7 29.05,39.5 23,39.5 21.5,38 8.55,38 R23.2 | v44,27 48,27 49,28 IC3.59
  Bottom 0.254: v44,27 35,36 v31,36
CS  (via drill 0.38)
  Top 0.254: U3.2 7.33,29.67 v8,29 | v33,46 v33,42 | v49,41 47.5,39.5 IC3.77
  Bottom 0.254: v8,29 8,48 11,51 28,51 v33,46 | v33,42 38,42 39,41 v49,41
DTR
  Top 0.254: C29.1 JP2.P$1
GND  (via drill 0.38, 0.5, 0.51)
  Top 0.203: U1.17 60.67,10.77 | U1.18 60.33,11.27 | 22.86,47.09 22.75,47.09
  Top 0.254: U4.11 22.75,47.09 22.75,47.17 | U4.9 23.76,45.9 | 23.76,45.9 23.76,46.41 | 23.76,45.9 23.76,46.41 v25.84,45.76 24.92,46.41 C27.2 | R17.1 81,31.9 v81,33 | R15.1 v82,18
  Top 0.406: 23.85,46.1 23.85,45.3 24.25,45.3 24.25,45.7 24.1,45.7
  Top 0.813: 75.95,27.75 77,27.75 77,27.85 | 60,12 60,11
  Bottom 0.406: 9.92,5.72 U2.60 v10.86,6.66
  Bottom 0.445: R7.1 9.92,5.72
  Bottom 0.61: 75.6,28 75.55,28 75.55,29.6 76.45,29.6 76.45,29.5 76.35,29.5 76.35,28.2 75.9,28.2 75.9,29.1
  Bottom 1.016: 76,27.75 75.85,27.75
  other vias: 25.27,7.65 17.97,8.29 17.97,14.32 24.32,3.84 63,22 78,8 76,24 76,22 75,22 75.45,34.4 41,11 53,41 32,39 4,26 10,21 4,21 34,6 40,27 30.2,30.15 10,26 3.85,33.35 14,29 33.45,20.7 65,41 63,27 57,35 63,17 76,33.4 73,45 63,32 42,52 29,17 79,45 41,16 75,24 81,9 82,11 76.55,34.4 63,2 58,2 57.65,40.55 53,2 53,6 35,41 65,45 73,50 15,17 15,21 25,30 27.15,30 24.89,46.56 25.84,46.76 43,20 49,12 79,8 81,8 19,21 19,17 49,19.9 10,35 13,2 29.2,36.15 69,41 43,9 48,9 52.5,27.8 81,10 45.9,32.25 77,8 76,8 76,25 40.1,36.4 63,12 63,6 19,45 19,50 16,50 34,14 29,14 29,4 44.5,36.4 43.8,39.8 44.6,39.8 29,45 35,45 76.55,36.4 75.45,36.4 47.3,41.95 40.2,16 41.8,16 84.9,39.8 85.8,41.85 32,38 29.55,30.75 38.25,17.55 37.4,17.55 54.25,28.95 54.25,29.75 48.35,29.8 45.6,28.25
  pour Bottom (isolate 0.305, rank 6): 1,54.02 89,54 89,17.97 88.92,16.97 88.92,0.19 9,0.19 9,19 1,19
  pour Top (no thermals): 80.45,13.3 83.3,13.3 83.3,6.35 75,6.35 75,13 80,13
  pour Top (no thermals): 75,26 75,27.2 75.6,27.8 75.6,28.35 77.25,28.35 77.25,27.5 77,27.5 77,21 74,21 74,25
  pour Top (no thermals): 75.55,29 75.55,32 75,32 75,37 77,37 77,30.4 76.4,30.4 76.4,29.5 76,29.5 76,29
  pour Top (rank 2): 64,38 64,0 9,0 9,19 1,19 1,54 89,54 89,38
GPS_EN  (via drill 0.38)
  Top 0.254: IC3.60 48.5,28.5 v48,28 | R22.2 36.85,9.85 v37,10
  Bottom 0.254: v48,28 48,24 44,20 44,11 43,10 v37,10
GPS_PWR  (via drill 0.38, 0.51)
  Top 0.254: 8.11,1.28 9.22,2.39 U2.36 9.21,4.03 9.21,4.69 9.68,5.16 v10.86,5.16 | 5.61,1.28 L1.1 C8.1 | U2.58 11.62,10.49 | 21.88,8.17 C5.1 | SJ3.1 27.64,4.93 28.12,5.42 | SJ2.1 26.94,10.45 28.12,10.45
  Top 0.305: 21.88,8.17 22.15,8.17 22.25,8.27 | 8.11,1.28 7.48,1.28 C8.1 | R3.2 18.68,5.01 v17.97,5.72
  Top 0.406: v12.38,6.66 12.38,9.66 U2.58 | 28.12,5.42 28.12,10.45 28.12,12.75 26.86,14.01 26.86,14 26.34,14.52 D1.2 | 22.25,8.27 25.59,4.93 SJ3.1 27.93,4.93 29,6 29,9.1 Q3.3 | U2.2 v17.97,5.72 17.97,7.01 18.48,7.52 C6.A 21.38,7.52 C5.1
  Bottom 0.406: v12.38,6.66 v10.86,5.16 11.86,4.16 15.11,4.16 16.68,5.72 v17.97,5.72
INT  (via drill 0.38)
  Top 0.254: v60,5 60,6.78 U1.12 | IC3.66 54.5,31.5 55,31 v55,27
  Bottom 0.254: v55,27 55,14 54,13 54,7 55,6 59,6 v60,5
MISO  (via drill 0.38)
  Top 0.254: IC3.22 28.5,25.5 27,24 v21,24 | U3.7 5.6,35 6,35 13,28 v17,28 18,28 J1.1
  Bottom 0.254: v21,24 v17,28
MOSI  (via drill 0.38)
  Top 0.254: IC3.21 28,26 27,25 13,25 v10,28 7.23,30.77 U3.3 | J1.4 16.54,33.54 13,30 v12,30
  Bottom 0.254: v12,30 v10,28
N$1
  Top 0.254: U1.20 58.26,13.41 C2.1
N$2
  Top 0.254: 57.76,6.42 U1.10
  Top 0.406: C4.1 57.76,6.42
N$3
  Top 0.254: 24.38,44.76 U4.8 26.29,44.75 26.81,45.27 26.81,48.57 25.67,49.72 22.04,49.72 21.75,49.45 21.73,49.43 C26.1
N$4
  Top 0.254: SJ2.2 25.27,9.55 21.46,13.37 20.73,13.37 R4.1
N$5
  Top 0.254: D1.1 24.28,12.21 R6.1
N$7
  Top 0.254: R8.2 66.63,46.63 67,47 68.05,47 Q5.1
N$8
  Top 0.254: Q6.3 54,48
  Top 1.27: D$1.A 53,47 54,48 54,50.39 S_WINCH.1
N$9
  Top 0.254: Q5.3 65.55,48.45 65,49 65,50.39 S_RUD.1
  Top 1.016: D$2.A 64,47
  Top 1.27: 64,47 65.2,48.2 65.2,50.19 S_RUD.1
N$10
  Top 0.254: Q6.1 58.09,48.04 R9.2
N$11  (via drill 0.38, 0.4, 0.5)
  Top 0.813: U$2.2 v84,11.8 v83.2,11.8 | 86,4 86,3.7 L3.P$1 | C19.1 v81.7,13.65
  Top 1.676: 86,4 v84,6 v84,7
  Bottom 1.676: v84,6 v84,11.8 v83.2,11.8 81.7,13.3 v81.7,13.65
N$13
  Top 0.254: U4.12 22.25,46.19 C26.2
N$14
  Top 0.254: 74,28.2 74,28
  Top 0.305: U$1.P7 74.55,28.75 74,28.2
  Top 0.813: 74,28 74,27 73.68,26.83 L2.P$1
N$15
  Top 0.254: U$2.5 84,16 83,17 80,17 79,16 79,15 R13.2
N$16
  Top 0.254: U4.10 23.25,46.66 23.62,47.03 C27.1
N$17  (via drill 0.38)
  Top 0.254: R17.2 79.65,30.2 | 79.65,30.2 R16.1 78.65,30.45 v77.5,30.45 | v74.95,30.4 U$1.P5 | C33.2 79.65,33.4 79.65,30.2
  Bottom 0.254: v77.5,30.45 77.65,30.4 v74.95,30.4
N$18
  Top 0.254: R18.2 74.8,25.95 74.8,28.1 U$1.P8
N$19
  Top 0.254: U$2.4 84.95,17.9 R15.2 R14.1 84.9,19.55 C18.2
N$20
  Top 0.406: Q4.3 16,41.2 16,41 15.33,41 CAM.2
N$21
  Top 0.254: Q4.1 15.25,39 11,39 10.25,39.75 R20.2 7.2,41.45 R23.1
N$22
  Top 0.254: Q3.1 34.9,10.05 R21.2 35,8.15 R22.1
N$23
  Top 0.254: U$1.P3 78.6,29.25 R1.2 80,28 81,28 83,30 83,35.9 Q1.3 85.95,38.95
N$24
  Top 0.254: Q1.1 86.95,42.9 R24.2
N$26
  Top 0.254: Q2.3 3.92,43.9 WIND.2
N$27
  Top 0.254: STATUS.C R25.1
N$28
  Top 0.254: Q2.1 7.85,46.1 R2.2 7.85,48.3 R10.1
N$29
  Top 0.406: R5.2 82.5,46.65 Q8.3
N$30
  Top 0.406: Q7.3 82,44.1 Q8.1 82,46 84,46 85,45 R19.2
N$31
  Top 0.254: R26.2 R27.2 81.15,40.8 Q7.1
N$32
  Top 0.813: U$2.6 83.05,15.6 82.4,16.25 C19.2
NAV  (via drill 0.38)
  Top 0.254: U2.7 17.72,9.72 v18,10 | v26,20 30,20 v33,23 | v36,26 v36,30 | v39,29 40,29 42,31 v44,31 | v47,32 IC3.78
  Bottom 0.254: v18,10 18,11 25,18 25,19 v26,20 | v33,23 v36,26 | v36,30 38,30 v39,29 | v44,31 46,31 v47,32
PSE_SEL
  Top 0.254: 17.34,10.52 17.97,11.13 17.97,11.94 18.41,12.37 21.66,12.37 24.16,9.87 24.16,7.49 25.91,5.75 SJ3.2 | 17.34,10.52 U2.8 | 17.34,10.52
RESET  (via drill 0.38)
  Top 0.254: 36,19 36,14 v38,12 38,4.55 RESET.3 RESET.4 | IC3.30 38,20.74 C16.1 37.49,20.49 36,19 | D4.A v47.9,15.8 RN1.1 44.67,14.68 v43,13 | v27,19 36,19 | C29.2 60.65,18 v51,18
  Top 0.406: 48.45,3 RESET.4
  Bottom 0.254: v43,13 39,13 v38,12 | v27,19 27,21 24,24 24,33.08 J1.5 | v51,18 48.8,15.8 v47.9,15.8
RFGND  (via drill 0.51)
  Top 0.254: U2.61 9.36,6.66 7.86,6.66 | U2.62 9.36,8.16 7.86,8.16
  Bottom 0.61: R7.2 6,5.72 6,5.75 8.25,5.75 8.25,5.25 7.6,5.25 7.6,5.15 7.65,5.15 7.65,6.15 6,6.15 6,6 8.25,6 8.25,10.7 7.81,10.7 v7.81,16.54
  other vias: 4,1.3 1.46,16.54 1.46,1.3 1.46,10.19 4,10.19
  pour Top: 8.45,0.03 8.45,17.81 0.19,17.81 0.19,0.03
  pour Bottom: 8.45,0.03 8.45,17.81 0.19,17.81 0.19,0.03
RSTN
  Top 0.254: U2.1 16.89,4.92 18.3,3.51 19.07,3.51 R3.1 C7.1
RUD_EN  (via drill 0.38)
  Top 0.254: IC3.74 52.5,35.5 53,35 v53,34 | v55,34 55,41 v56,42 | R8.1 68.33,43.33 v68,43
  Bottom 0.254: v53,34 v55,34 | v56,42 57,43 66,43 v68,43
RUD_V  (via drill 0.38)
  Top 0.254: IC3.23 29,25 v27,23 | v26,31 v30,35
  Bottom 0.254: S_RUD.3 59.56,50.56 59,51 57,51 55,49 53,49 46,42 39,42 38,43 33,43 30,40 v30,35 | v27,23 26,24 v26,31
RX_D0  (via drill 0.38)
  Top 0.254: IC3.2 37.5,35.5 v38,35
  Bottom 0.254: v38,35 40,33 50,33 52,31 55,31 60,26 JP2.P$3
RXD1  (via drill 0.38)
  Top 0.254: v45,25 45.5,24.5 IC3.45
  Bottom 0.254: v45,25 39,25 35,29 29.87,29 22.6,36.27 22.6,36.9 20,39.5 20,41 17,44 16,44 13.22,46.78 CAM.3
RXD2  (via drill 0.38)
  Top 0.254: v31,8 31,3 30,2 16.64,2 15.62,3.02 U2.44 | v31,28 31,29.95 31.55,30.5 IC3.12
  Bottom 0.254: v31,8 v31,28
SCK  (via drill 0.38)
  Top 0.254: IC3.20 27.5,26.5 27,26 v22,26 14,26 7.03,32.97 U3.5
  Bottom 0.254: J1.3 21.46,33.54 23,32 23,27 v22,26
SCL  (via drill 0.38)
  Top 0.254: 47.5,17.5 44.5,20.5 IC3.43 44.5,23.5 42,26 v42,30 | 47.5,17.5 49,16 54.55,16 56.75,13.8 U1.23 | RN1.2 46.6,16.6 47.5,17.5 | U4.1 22.25,40.95 23.2,40 29.2,40 30.3,38.9 30.3,37.7 v31,37
  Bottom 0.254: v31,37 35,37 v42,30
SDA  (via drill 0.38)
  Top 0.254: U1.24 56.26,12.74 v54,15 | v54,17 49,17 45,21 IC3.44 45,24 v43,26 | RN1.3 45.4,17.4 v46,18 | v22.2,40 21.63,40.57 U4.16
  Bottom 0.254: v54,15 v54,17 52,19 47,19 v46,18 | v43,26 36,33 30,33 23,40 v22.2,40
STATUS_LED
  Top 0.254: IC3.58 51.5,27.5 53,26 53,24.25 STATUS.A
TX_D0  (via drill 0.38)
  Top 0.254: v42,34 38,34 37,35 IC3.3 | v58,30 58,25.19 JP2.P$2
  Bottom 0.254: v42,34 50,34 52,32 56,32 v58,30
TXD1  (via drill 0.38)
  Top 0.254: IC3.46 46,25 45,26 v44,26
  Bottom 0.254: v44,26 36,34 30,34 23,41 21,41 17,45 16.41,45 CAM.4
TXD2  (via drill 0.38)
  Top 0.203: 34.14,30.02 IC3.13
  Top 0.254: U2.42 14.02,2.98 16,1 30,1 32,3 v32,6 | IC3.13 33,30 32,29 32,27.8 v32.2,27.6
  Bottom 0.254: v32,6 32,27.4 v32.2,27.6
V_BATT
  Top 0.254: R1.1 80,24
  Top 0.305: 77.85,28.7 77.85,28.75 U$1.P2
  Top 0.406: 77.9,28.6 77.85,28.7 | 82,23 82,24 JP1.1 88,29 88,44 87,45 R19.1 85.85,44 84,44 Q8.2
  Top 0.61: 77.9,28.6 C21.1 78,26.7
  Top 1.016: 80,24 78,24 78,26.7
  Top 1.27: 80,24 82,24
  pour Top (no thermals): 89,29 84,29 81.8,26.7 78.35,26.7 77.5,26.5 77.5,23.6 79,22 86,22 86,13.25 85.05,13.2 85.05,7 86,6 89,6
V_BATT_DIV  (via drill 0.38)
  Top 0.203: 42.52,38.1 IC3.87
  Top 0.254: 42.52,38.1 42.52,42.52 43.8,43.8 48.85,43.8 49.85,42.8 57.2,42.8 v58,42 | R11.2 86.85,47.9 v86.4,47.45 86.85,47 R5.1
  Bottom 0.254: v58,42 78,42 80,44 84,44 86,46 86,47.05 v86.4,47.45
VBAT
  Top 0.254: U2.18 10.81,14.46 12.62,16.27 19.73,16.27 21,15 | 20.51,14.49 C10.1 21,14.75 21,15 | R6.2 23.5,15.27 23.05,15.27 22.78,15 21,15
  Top 0.406: 23.05,15.27 22.15,16.17 C30.VCC
VCC_EN  (via drill 0.38)
  Top 0.203: 48.01,37.95 IC3.76
  Top 0.254: 48.01,37.95 IC3.76 v49,39 | v84,39 84,41.85 R24.1
  Bottom 0.254: v49,39 v84,39
WINCH_EN  (via drill 0.38)
  Top 0.254: IC3.73 51,35 v52,34 | v56,34 v56,41 | R9.1 58.99,46 v58,46
  Bottom 0.254: v56,41 55,42 55,43 v58,46 | v52,34 53,33 55,33 v56,34
WIND_EN  (via drill 0.38)
  Top 0.254: IC3.57 49,27 48,26 v47,26 | v48,31 48,36 50,38 50,42 49,43 v44,43 | v33,52 9.85,52 R10.2
  Bottom 0.254: v47,26 47,30 v48,31 | v33,52 34,52 39,47 41,47 44,44 v44,43
WN_V  (via drill 0.38)
  Top 0.254: IC3.24 29.5,24.5 27,22 v24,22 | v9,47 9,49 11,51 30,51 32,49 45,49 47,51 48.19,51 S_WINCH.3
  Bottom 0.254: v24,22 22,24 9,38 v9,47
WS_1  (via drill 0.38)
  Top 0.254: v37,47 37,44 41.5,39.5 IC3.89
  Bottom 0.254: v37,47 31,53 11,53 6.3,48.3 WIND.4
WS_2  (via drill 0.38)
  Top 0.254: v40,43 40,42 42,40 IC3.88
  Bottom 0.254: v40,43 31,52 11,52 4.76,45.76 WIND.3
XTAL1
  Top 0.254: IC3.34 40,21 41,20 41.14,20 R12.1 41.8,19.54 Y1.3
XTAL2
  Top 0.254: IC3.33 39.46,21.96 R12.2 39.46,18.04 Y1.1

### Text on the board
Bottom: ARDUSAILOR V5.3
tPlace: Y | Z | X
tNames: GND | GND | WS1 | CAM_RX | WS2 | CAM_TX | VCC | VCC | GND | GND | GND | V_BATT